# EAGLE design rpi-hxb-shield (EAGLE 6.4)
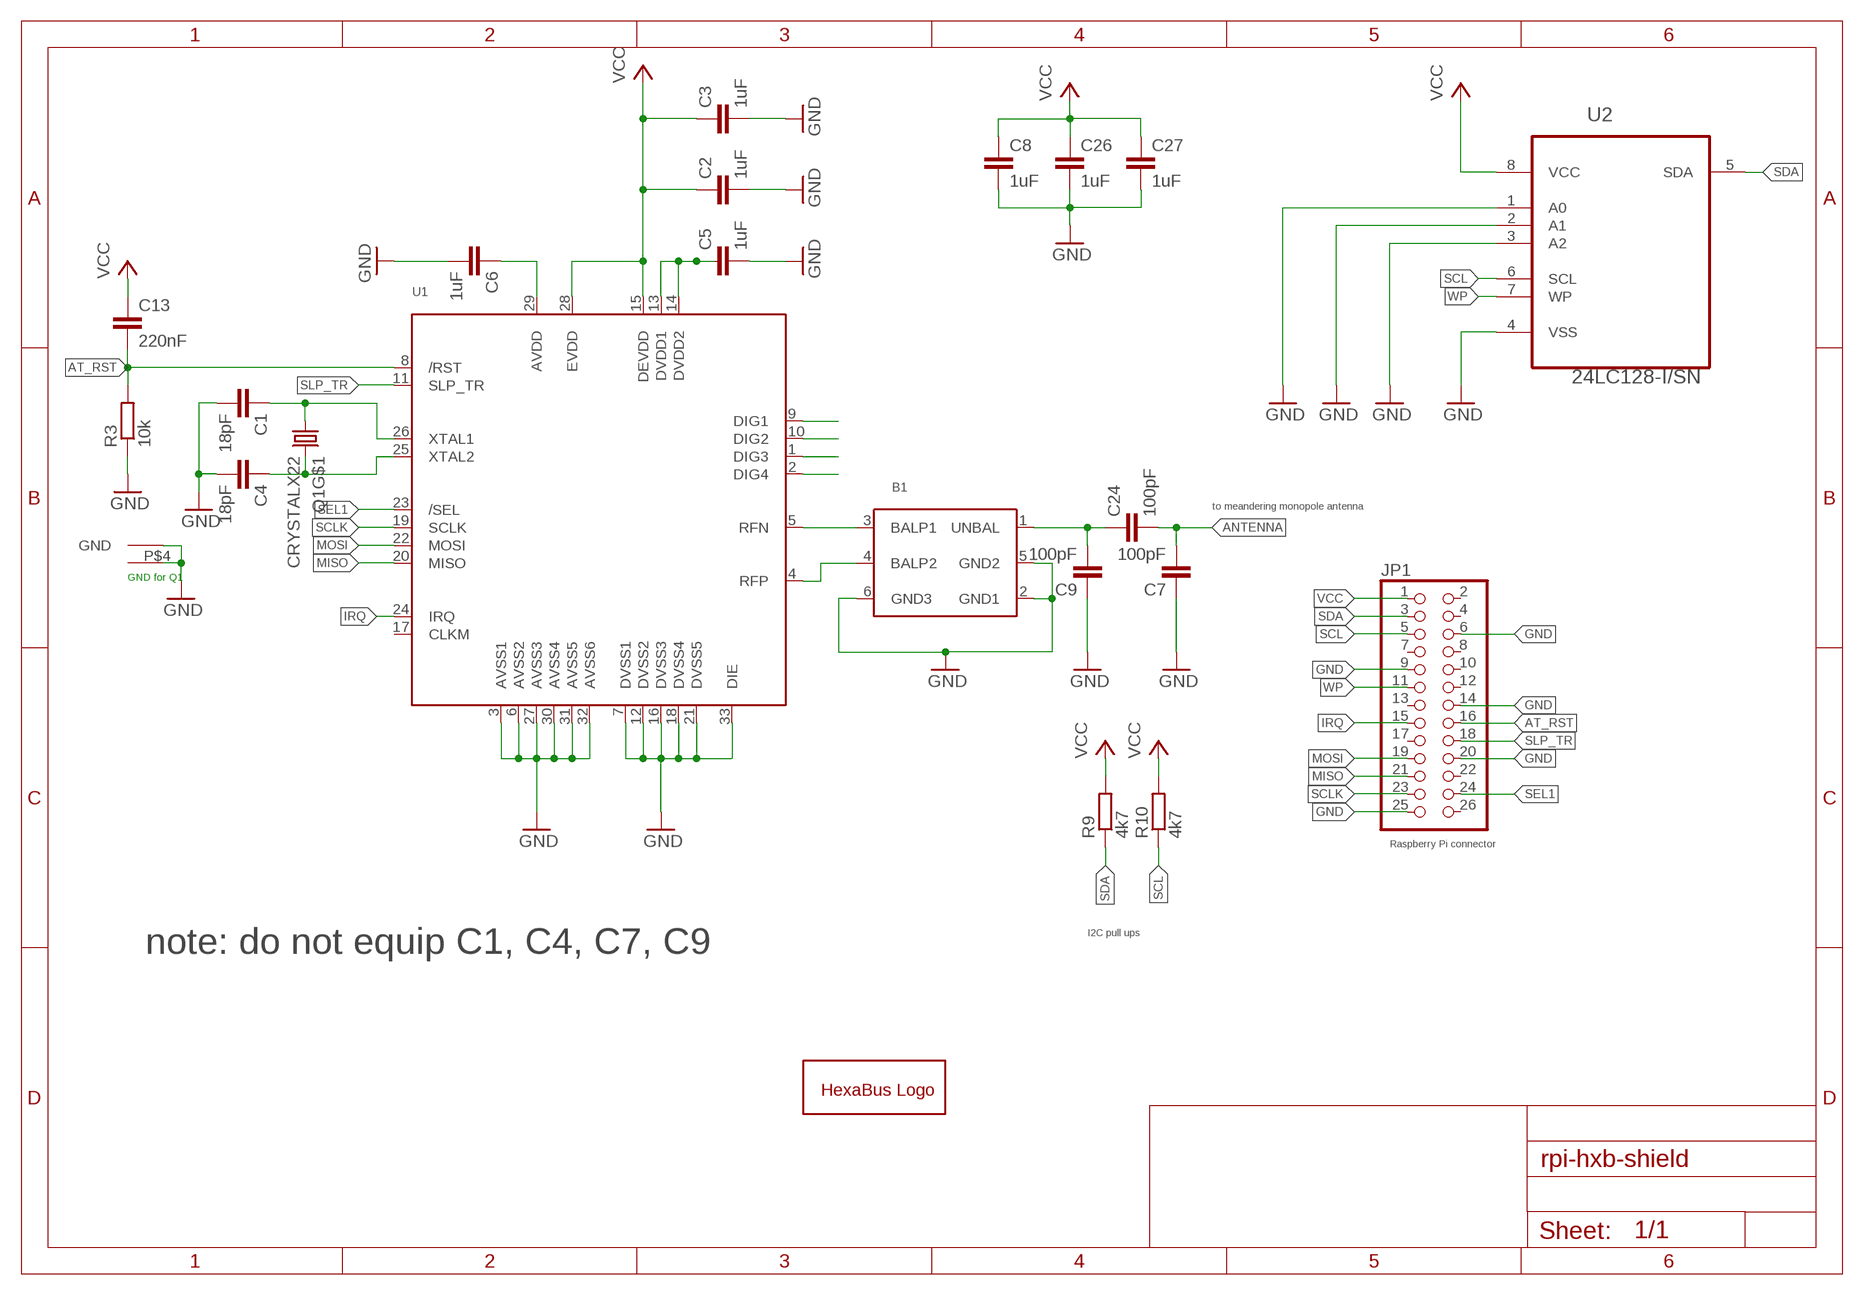
[diagram p0: schematic, sheet 1]

## Parts
B1  BALUN+LP  [BALUN0805]
C1  18pF  C-EUC0402K  [C0402K]
C2  1uF  C-EUC0402K  [C0402K]
C3  1uF  C-EUC0402K  [C0402K]
C4  18pF  C-EUC0402K  [C0402K]
C5  1uF  C-EUC0402K  [C0402K]
C6  1uF  C-EUC0402K  [C0402K]
C7  100pF  C-EUC0402K  [C0402K]
C8  1uF  C-EUC0402K  [C0402K]
C9  100pF  C-EUC0402K  [C0402K]
C13  220nF  C-EUC0402K  [C0402K]
C24  100pF  C-EUC0402K  [C0402K]
C26  1uF  C-EUC0402K  [C0402K]
C27  1uF  C-EUC0402K  [C0402K]
JP1  PINHD-2X13  [2X13]
Q1  CRYSTALX22  [X22]
R3  10k  R-EU_R0402  [R0402]
R9  4k7  R-EU_R0402  [R0402]
R10  4k7  R-EU_R0402  [R0402]
U1  AT86RF212  [32QN2]
U2  24LC128-I/SN  [SOIC127P600X175-8N]
U$1  HEXAKRAKE  [HEXAKRAKE]

## Nets
ANTENNA: C7.2 C24.2
AT_RST: C13.2 JP1.16 R3.2 U1.8(/RST)
GND: B1.2(GND1) B1.5(GND2) B1.6(GND3) C1.2 C2.2 C3.2 C4.2 C5.2 C6.2 C7.1 C8.2 C9.1 C26.2 C27.2 JP1.6 JP1.9 JP1.14 JP1.20 JP1.25 Q1.P$2(GND) Q1.P$4(GND1) R3.1 U1.3(AVSS1) U1.6(AVSS2) U1.7(DVSS1) U1.12(DVSS2) U1.16(DVSS3) U1.18(DVSS4) U1.21(DVSS5) U1.27(AVSS3) U1.30(AVSS4) U1.31(AVSS5) U1.32(AVSS6) U1.33(DIE) U2.1(A0) U2.2(A1) U2.3(A2) U2.4(VSS)
IRQ: JP1.15 U1.24(IRQ)
MISO: JP1.21 U1.20(MISO)
MOSI: JP1.19 U1.22(MOSI)
N$1: C6.1 U1.29(AVDD)
N$2: C5.1 U1.13(DVDD1) U1.14(DVDD2)
N$3: U1.9(DIG1)
N$6: U1.10(DIG2)
N$7: U1.1(DIG3)
N$8: U1.2(DIG4)
N$28: B1.3(BALP1) U1.5(RFN)
N$29: B1.4(BALP2) U1.4(RFP)
N$30: C1.1 Q1.P$1 U1.26(XTAL1)
N$31: C4.1 Q1.P$3 U1.25(XTAL2)
N$33: B1.1(UNBAL) C9.2 C24.1
SCL: JP1.5 R10.1 U2.6(SCL)
SCLK: JP1.23 U1.19(SCLK)
SDA: JP1.3 R9.1 U2.5(SDA)
SEL1: JP1.24 U1.23(/SEL)
SLP_TR: JP1.18 U1.11(SLP_TR)
VCC: C2.1 C3.1 C8.1 C13.1 C26.1 C27.1 JP1.1 R9.2 R10.2 U1.15(DEVDD) U1.28(EVDD) U2.8(VCC)
WP: JP1.11 U2.7(WP)
Unconnected: JP1.2 JP1.4 JP1.7 JP1.8 JP1.10 JP1.12 JP1.13 JP1.17 JP1.22 JP1.26 U1.17(CLKM)

## Notes on the sheet
- to meandering monopole antenna
- GND for Q1
- Raspberry Pi connector
- I2C pull ups
- note: do not equip C1, C4, C7, C9

## Library data of the parts
B1 = microbuilder:BALUN+LP: Balun + Low Pass Filter 0805 863-928 MHz Balun + Low Pass Filter (0805) - Digikey: 712-1473-1-ND
C1-C9 C13 C24 C26 C27 = rcl:C-EU: CAPACITOR, European symbol
JP1 = pinhead:PINHD-2X13: PIN HEADER
Q1 = crystals-new:CRYSTAL
R3 R9 R10 = rcl:R-EU_: RESISTOR, European symbol
U1 = microbuilder:AT86RF212: AT86RF212 - Low-Power SPI-based 700/800/900 MHz Transceiver Digikey: AT86RF212-ZU-ND
U2 = hexabus:24LC128-I/SN: 128K I2C CMOS Serial EEPROM; MPN: 24LC128-I/SN; OC_FARNELL: 9757937; OC_NEWARK: 12C2008; PACKAGE: SOIC-8; SUPPLIER: MICROCHIP
U$1 = artwork:HEXAKRAKE

## Board
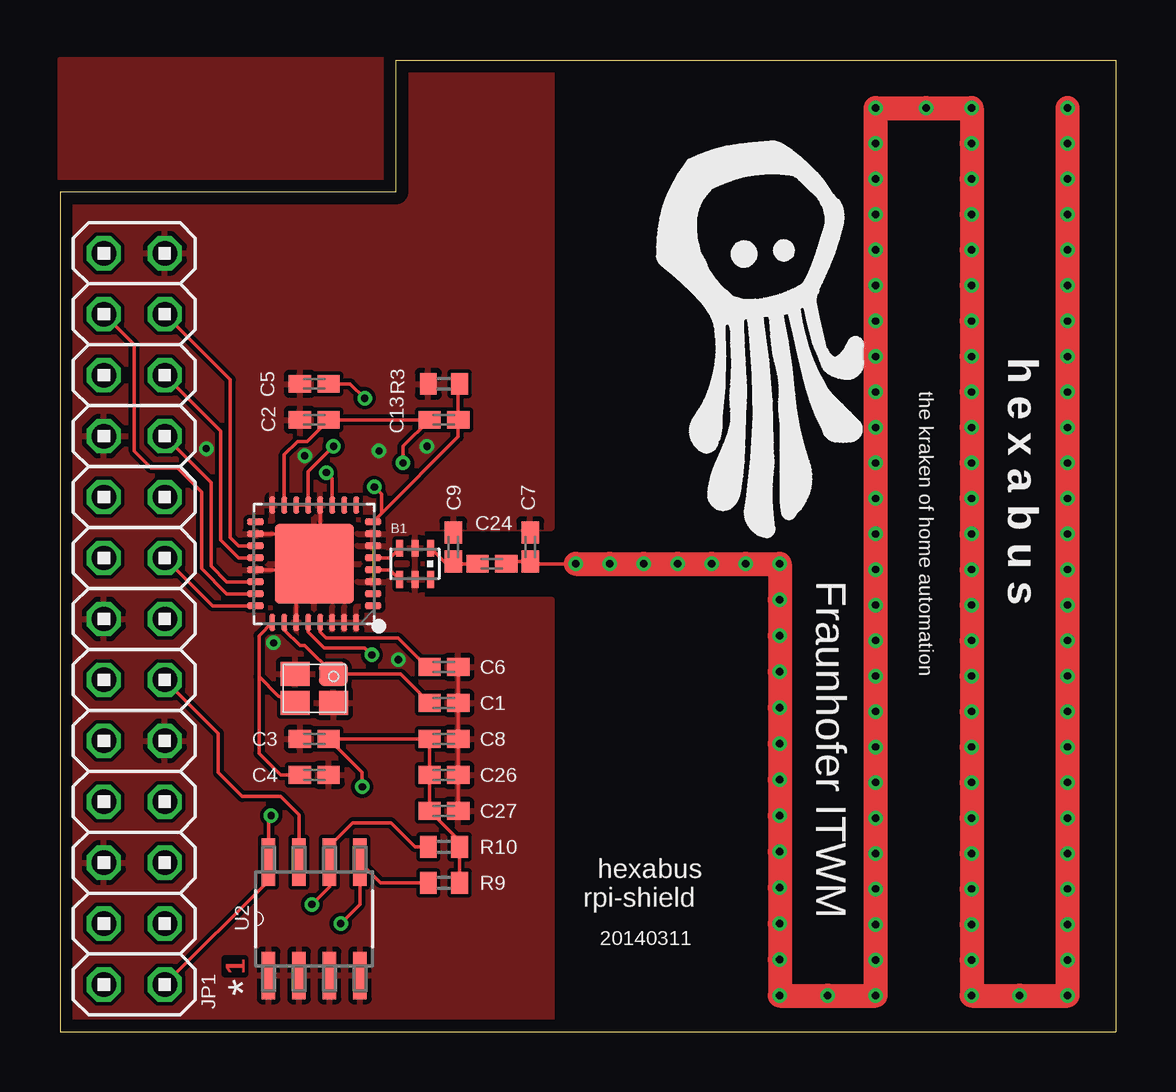
[diagram p1: board, top side]
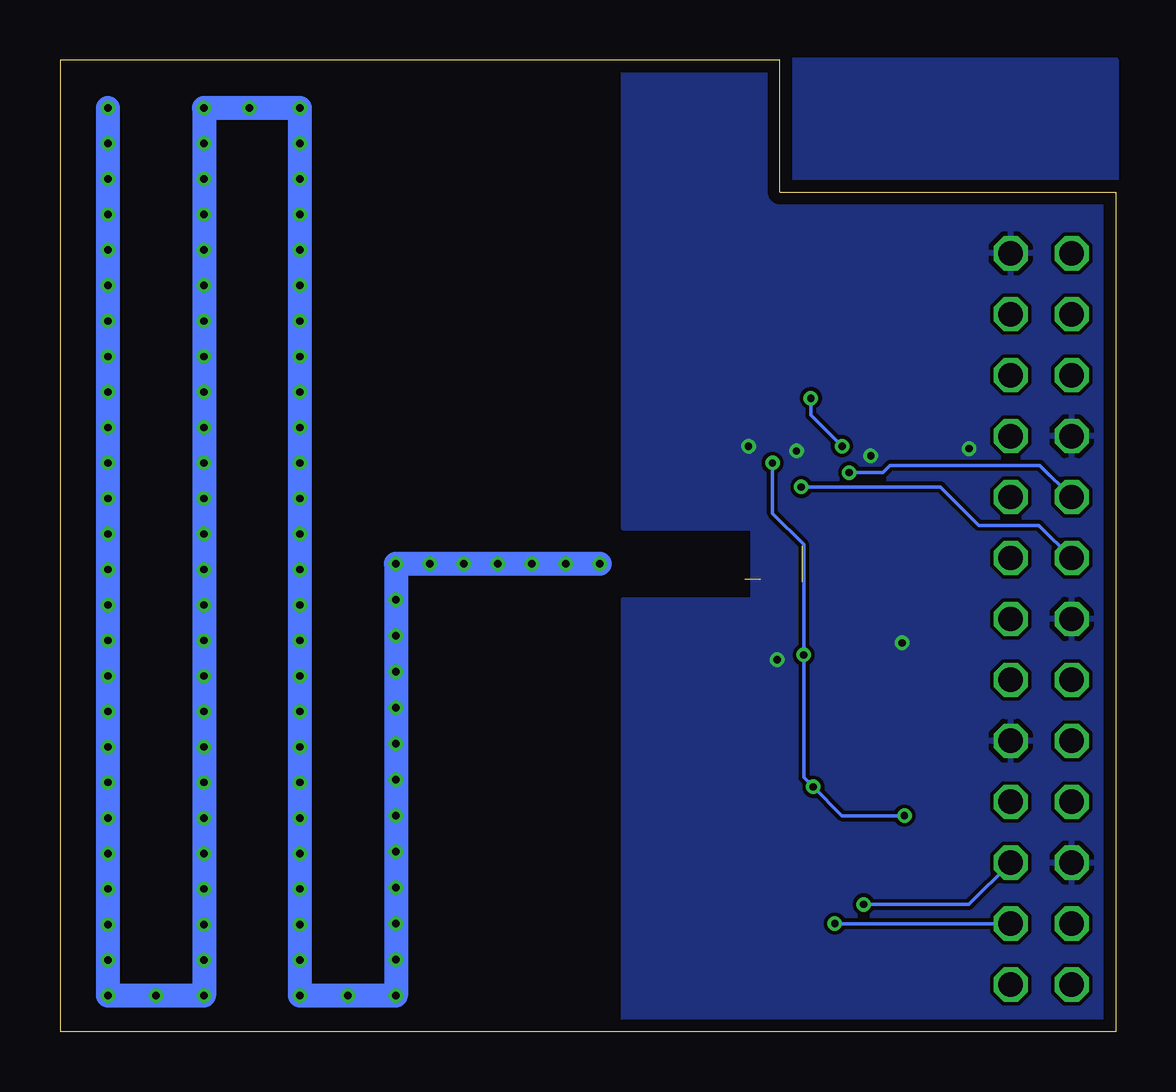
[diagram p2: board, bottom side, seen from below]

Size 44 x 40.5 mm. Coordinates in mm from the lower left corner, seen from the top.
Outline: 0,0 44,0 44,40.5 14,40.5 14,35 0,35 0,0
Copper layers (1*16): Top 0.035mm / dielectric 1.5mm / Bottom 0.035mm
Design rules "leiton": minimum track width 6mil, minimum drill 0.3mm, track to track 6mil, track to pad 6mil, pad to pad 6mil, via to via 6mil, smd to smd 6mil, copper to edge 20mil, drill to drill 8mil, minimum pad ring 8mil, minimum via ring 6mil, stop-mask expansion 3mil, vias tented up to drill 0mil, thermal gap 8mil

### Footprints (pad centres in the part's own frame; a part is rotated, then mirrored left to right if it is on the bottom)
BALUN0805 = smd 0.3 x 0.7: 1 0.65,0.65; 2 0,0.65; 3 -0.65,0.65; 4 -0.65,-0.65; 5 0,-0.65; 6 0.65,-0.65
C0402K = smd 0.925 x 0.74: 1 -0.6,0; 2 0.6,0
2X13 = drill 1.016 octagon: 1 -15.24,-1.27; 2 -15.24,1.27; 3 -12.7,-1.27; 4 -12.7,1.27; 5 -10.16,-1.27; 6 -10.16,1.27; 7 -7.62,-1.27; 8 -7.62,1.27; 9 -5.08,-1.27; 10 -5.08,1.27; 11 -2.54,-1.27; 12 -2.54,1.27; 13 0,-1.27; 14 0,1.27; 15 2.54,-1.27; 16 2.54,1.27; 17 5.08,-1.27; 18 5.08,1.27; 19 7.62,-1.27; 20 7.62,1.27; 21 10.16,-1.27; 22 10.16,1.27; 23 12.7,-1.27; 24 12.7,1.27; 25 15.24,-1.27; 26 15.24,1.27
X22 = smd 1.2 x 1: P$1 -0.8,-0.6; P$2 0.8,-0.6; P$3 0.8,0.6; P$4 -0.8,0.6
R0402 = smd 0.7 x 0.9: 1 -0.65,0; 2 0.65,0
32QN2 = smd 0.7 x 0.25: 1 -2.45,1.75; 2 -2.45,1.25; 3 -2.45,0.75; 4 -2.45,0.25; 5 -2.45,-0.25; 6 -2.45,-0.75; 7 -2.45,-1.25; 8 -2.45,-1.75; 17 2.45,-1.75; 18 2.45,-1.25; 19 2.45,-0.75; 20 2.45,-0.25; 21 2.45,0.25; 22 2.45,0.75; 23 2.45,1.25; 24 2.45,1.75 | smd 0.25 x 0.7: 9 -1.75,-2.45; 10 -1.25,-2.45; 11 -0.75,-2.45; 12 -0.25,-2.45; 13 0.25,-2.45; 14 0.75,-2.45; 15 1.25,-2.45; 16 1.75,-2.45; 25 1.75,2.45; 26 1.25,2.45; 27 0.75,2.45; 28 0.25,2.45; 29 -0.25,2.45; 30 -0.75,2.45; 31 -1.25,2.45; 32 -1.75,2.45 | smd 3.3 x 3.3: 33 0,0
SOIC127P600X175-8N = smd 1.981 x 0.559: 1 -2.362,1.905; 2 -2.362,0.635; 3 -2.362,-0.635; 4 -2.362,-1.905; 5 2.362,-1.905; 6 2.362,-0.635; 7 2.362,0.635; 8 2.362,1.905

### Placement (x,y rotation side)
B1  14.8,19.5 0 top
C1  16,13.7 0 top
C2  10.6,25.5 180 top
C3  10.6,12.2 180 top
C4  10.6,10.7 0 top
C5  10.6,27 180 top
C6  16,15.2 0 top
C7  19.6,20.2 270 top
C8  16,12.2 0 top
C9  16.4,20.2 270 top
C13  16,25.5 0 top
C24  18,19.5 0 top
C26  16,10.7 0 top
C27  16,9.2 0 top
JP1  3.1,17.2 90 top
Q1  10.6,14.3 180 top
R3  16,27 0 top
R9  16,6.2 0 top
R10  16,7.7 0 top
U1  10.6,19.5 180 top
U2  10.6,4.7 90 top
U$1  24.9,20.7 0 top

### Tracks (layer width: path | path; a pad name or v marks a point on that pad's centre or on a via)
ANTENNA  (via drill 0.3)
  Top 0.152: C24.2 18.7,19.6 C7.2 19.7,19.5 v21.5,19.5
  Top 0.254: v34,10.38 34.1,10.38 34.1,11.9 | v38,22.22 38,20.7
  Top 1: v21.5,19.5 v22.92,19.5 v24.33,19.5 v25.75,19.5 v27.16,19.5 v28.58,19.5 v30,19.5 v30,18 v30,16.5 v30,15 v30,13.5 v30,12 v30,10.5 v30,9 v30,7.5 v30,6 v30,4.5 v30,3 v30,1.5 v32,1.5 v34,1.5 v34,2.98 v34,4.46 v34,5.94 v34,7.42 v34,8.9 v34,10.38 v34,11.86 v34,13.34 v34,14.82 v34,16.3 v34,17.78 v34,19.26 v34,20.74 v34,22.22 v34,23.7 v34,25.18 v34,26.66 v34,28.14 v34,29.62 v34,31.1 v34,32.58 v34,34.06 v34,35.54 v34,37.02 v34,38.5 v36.1,38.5 v38,38.5 v38,37.02 v38,35.54 v38,34.06 v38,32.58 v38,31.1 v38,29.62 v38,28.14 v38,26.66 v38,25.18 v38,23.7 v38,22.22 v38,20.74 38,20.7 v38,19.26 v38,17.78 v38,16.3 v38,14.82 v38,13.34 v38,11.86 v38,10.38 v38,8.9 v38,7.42 v38,5.94 v38,4.46 v38,2.98 v38,1.5 v40,1.5 v42,1.5 v42,2.98 v42,4.46 v42,5.94 v42,7.42 v42,8.9 v42,10.38 v42,11.86 v42,13.34 v42,14.82 v42,16.3 v42,17.78 v42,19.26 v42,20.74 v42,22.22 v42,23.7 v42,25.18 v42,26.66 v42,28.14 v42,29.62 v42,31.1 v42,32.58 v42,34.06 v42,35.54 v42,37.02 v42,38.5
  Bottom 1: v21.5,19.5 v30,19.5 v30,1.5 v34,1.5 v34,38.5 v38,38.5 v38,1.5 v42,1.5 v42,38.5
AT_RST  (via drill 0.3)
  Top 0.152: R3.2 16.6,26.95 C13.2 16.6,24.8 13.4,21.6 | 13.4,21.6 U1.8 | v13.1,22.7 13.4,22.4 13.4,21.6
  Bottom 0.152: JP1.16 3.19,21.1 5.7,21.1 7.3,22.7 v13.1,22.7
GND  (via drill 0.3)  (2 unrouted)
  Top 0.152: C6.2 C1.2 C8.2 C26.2 C27.2 | U1.21 10.35,19.25 U1.33 | U1.18 9.35,20.75 U1.33 | U1.12 10.85,20 | 10.85,20 10.85,19.75 U1.33 | U1.27 9.85,19 10.85,20
  other vias: 6.1,24.3 13.3,24.2 8.9,16.2 10.2,24 14.1,15.5 15.3,24.4
  pour Bottom: 0,0 20.5,0 20.5,18 15.1,18 15.1,21 20.5,21 20.5,40.5 0,40.5
  pour Top: 0,0 20.5,0 20.5,18 15.1,18 15.1,21 20.5,21 20.5,40.5 0,40.5
IRQ
  Top 0.152: U1.24 6.36,17.75 JP1.15
MISO
  Top 0.152: JP1.21 6.62,25.11 6.7,25.03 6.7,20.5 7.45,19.75 U1.20
MOSI
  Top 0.152: JP1.19 6.3,22.89 6.3,19.4 6.95,18.75 U1.22
N$1
  Top 0.152: U1.29 10.85,16.65 11.1,16.4 14.1,16.4 15.3,15.2 C6.1
N$2  (via drill 0.3)
  Top 0.152: U1.14 U1.13 10.35,23.35 v11.4,24.4 | v12.7,26.4 12.1,27 C5.1
  Bottom 0.152: v11.4,24.4 12.7,25.7 v12.7,26.4
N$28
  Top 0.152: B1.3 13.75,19.75 U1.5
N$29
  Top 0.152: B1.4 13.75,19.25 U1.4
N$30
  Top 0.152: 11.4,15.3 Q1.P$1 | Q1.P$1 10.2,16.1 10,16.1 9.35,16.75 U1.26 | Q1.P$1 14.2,14.9 C1.1
N$31
  Top 0.152: U1.25 8.3,16.5 8.3,14.8 | 8.3,14.8 9.1,14 Q1.P$3 | C4.1 9.2,10.7 8.3,11.6 8.3,14.8
N$33
  Top 0.152: B1.1 16,19.6 C9.2 16.5,19.5 C24.1
SCL  (via drill 0.3)
  Top 0.152: v10.5,5.3 11.23,6.04 U2.6 11.23,7.74 12.2,8.7 13.8,8.7 14.8,7.7 R10.1
  Bottom 0.152: v10.5,5.3 6.11,5.3 JP1.5
SCLK
  Top 0.152: JP1.23 7.1,27.17 7.1,20.6 7.45,20.25 U1.19
SDA  (via drill 0.3)
  Top 0.152: R9.1 13.37,6.2 U2.5 12.51,5.3 v11.7,4.5
  Bottom 0.152: JP1.3 v11.7,4.5
SEL1
  Top 0.152: U1.23 6.95,18.25 5.9,19.3 5.9,22.5 4.9,23.5 3.8,23.5 3.1,24.2 3.1,28.63 JP1.24
SLP_TR  (via drill 0.3)
  Top 0.152: U1.11 11.35,23.05 v11.1,23.3
  Bottom 0.152: JP1.18 3.15,23.6 9.4,23.6 9.7,23.3 v11.1,23.3
VCC  (via drill 0.3)
  Top 0.152: R9.2 R10.2 16.65,7.95 C27.1 C26.1 C8.1 C3.1 12.6,10.8 v12.6,10.2 | JP1.1 8.7,6.29 U2.8 8.7,8.89 v8.8,9 | U1.15 9.35,24.05 9.9,24.6 10.3,24.6 C2.1 C13.1 14.3,24.4 v14.3,23.7 | U1.28 10.35,16.65 11,16 12.7,16 v13,15.7
  Bottom 0.152: v8.8,9 11.4,9 v12.6,10.2 13,10.6 v13,15.7 13,20.3 14.3,21.6 v14.3,23.7
WP
  Top 0.152: JP1.11 6.6,12.43 6.6,10.8 7.6,9.8 9.2,9.8 9.96,9.04 U2.7

### Text on the board
Top: 1
tPlace: h e x a b u s | the kraken of home automation | Fraunhofer ITWM | hexabus | rpi-shield | 20140311